# EAGLE schematic Sequencer-Memory-V1.0-3 (EAGLE 7.6.0)

## Sheet 1 of 4: Memory
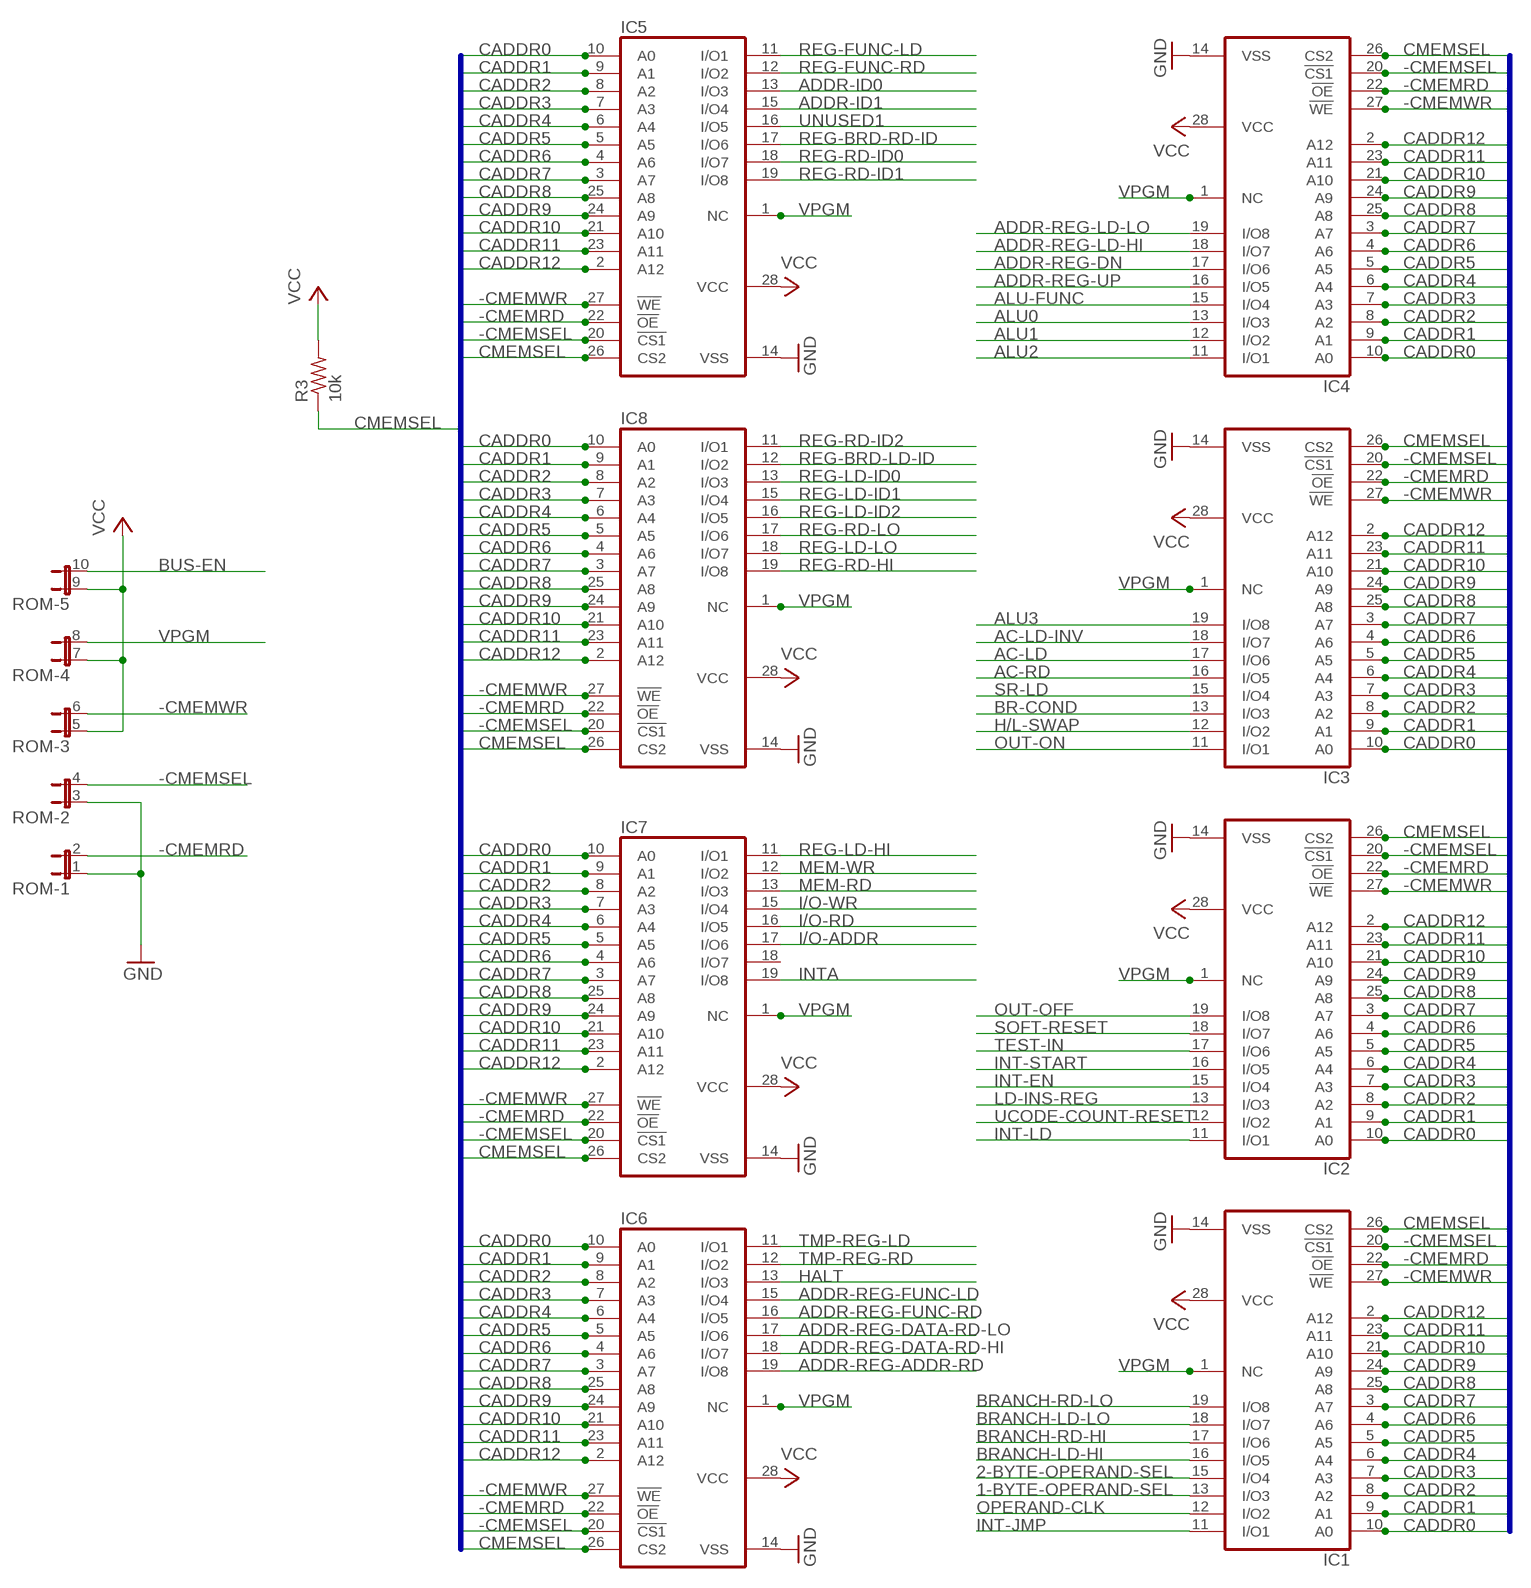
[diagram p0: schematic, sheet 1]

### Parts
IC1  6264A  [DIL28-6]
IC2  6264A  [DIL28-6]
IC3  6264A  [DIL28-6]
IC4  6264A  [DIL28-6]
IC5  6264A  [DIL28-6]
IC6  6264A  [DIL28-6]
IC7  6264A  [DIL28-6]
IC8  6264A  [DIL28-6]
R3  10k  R-US_0207/10  [0207/10]
ROM  JP5QE  [JP5Q]

### Nets
1-BYTE-OPERAND-SEL: IC1.13(I/O3) ; also sheet 2,4
2-BYTE-OPERAND-SEL: IC1.15(I/O4) ; also sheet 2,4
-CMEMRD: IC1.22(!OE) IC2.22(!OE) IC3.22(!OE) IC4.22(!OE) IC5.22(!OE) IC6.22(!OE) IC7.22(!OE) IC8.22(!OE) ROM.2 ; also sheet 3
-CMEMSEL: IC1.20(!CS1) IC2.20(!CS1) IC3.20(!CS1) IC4.20(!CS1) IC5.20(!CS1) IC6.20(!CS1) IC7.20(!CS1) IC8.20(!CS1) ROM.4 ; also sheet 3
-CMEMWR: IC1.27(!WE) IC2.27(!WE) IC3.27(!WE) IC4.27(!WE) IC5.27(!WE) IC6.27(!WE) IC7.27(!WE) IC8.27(!WE) ROM.6 ; also sheet 3
AC-LD: IC3.17(I/O6) ; also sheet 2,4
AC-LD-INV: IC3.18(I/O7) ; also sheet 2,4
AC-RD: IC3.16(I/O5) ; also sheet 2,4
ADDR-ID0: IC5.13(I/O3) ; also sheet 2,4
ADDR-ID1: IC5.15(I/O4) ; also sheet 2,4
ADDR-REG-ADDR-RD: IC6.19(I/O8) ; also sheet 2,4
ADDR-REG-DATA-RD-HI: IC6.18(I/O7) ; also sheet 2,4
ADDR-REG-DATA-RD-LO: IC6.17(I/O6) ; also sheet 2,4
ADDR-REG-DN: IC4.17(I/O6) ; also sheet 2,4
ADDR-REG-FUNC-LD: IC6.15(I/O4) ; also sheet 2,4
ADDR-REG-FUNC-RD: IC6.16(I/O5) ; also sheet 2,4
ADDR-REG-LD-HI: IC4.18(I/O7) ; also sheet 2,4
ADDR-REG-LD-LO: IC4.19(I/O8) ; also sheet 2,4
ADDR-REG-UP: IC4.16(I/O5) ; also sheet 2,4
ALU0: IC4.13(I/O3) ; also sheet 2,4
ALU1: IC4.12(I/O2) ; also sheet 2,4
ALU2: IC4.11(I/O1) ; also sheet 2,4
ALU3: IC3.19(I/O8) ; also sheet 2,4
ALU-FUNC: IC4.15(I/O4) ; also sheet 2,4
BR-COND: IC3.13(I/O3) ; also sheet 4
BRANCH-LD-HI: IC1.16(I/O5) ; also sheet 2,4
BRANCH-LD-LO: IC1.18(I/O7) ; also sheet 2,4
BRANCH-RD-HI: IC1.17(I/O6) ; also sheet 2,4
BRANCH-RD-LO: IC1.19(I/O8) ; also sheet 2,4
BUS-EN: ROM.10 ; also sheet 2,3
CADDR0: IC1.10(A0) IC2.10(A0) IC3.10(A0) IC4.10(A0) IC5.10(A0) IC6.10(A0) IC7.10(A0) IC8.10(A0) ; also sheet 2,4
CADDR1: IC1.9(A1) IC2.9(A1) IC3.9(A1) IC4.9(A1) IC5.9(A1) IC6.9(A1) IC7.9(A1) IC8.9(A1) ; also sheet 2,4
CADDR2: IC1.8(A2) IC2.8(A2) IC3.8(A2) IC4.8(A2) IC5.8(A2) IC6.8(A2) IC7.8(A2) IC8.8(A2) ; also sheet 2,4
CADDR3: IC1.7(A3) IC2.7(A3) IC3.7(A3) IC4.7(A3) IC5.7(A3) IC6.7(A3) IC7.7(A3) IC8.7(A3) ; also sheet 2,4
CADDR4: IC1.6(A4) IC2.6(A4) IC3.6(A4) IC4.6(A4) IC5.6(A4) IC6.6(A4) IC7.6(A4) IC8.6(A4) ; also sheet 2,4
CADDR5: IC1.5(A5) IC2.5(A5) IC3.5(A5) IC4.5(A5) IC5.5(A5) IC6.5(A5) IC7.5(A5) IC8.5(A5) ; also sheet 2,4
CADDR6: IC1.4(A6) IC2.4(A6) IC3.4(A6) IC4.4(A6) IC5.4(A6) IC6.4(A6) IC7.4(A6) IC8.4(A6) ; also sheet 2,4
CADDR7: IC1.3(A7) IC2.3(A7) IC3.3(A7) IC4.3(A7) IC5.3(A7) IC6.3(A7) IC7.3(A7) IC8.3(A7) ; also sheet 2,4
CADDR8: IC1.25(A8) IC2.25(A8) IC3.25(A8) IC4.25(A8) IC5.25(A8) IC6.25(A8) IC7.25(A8) IC8.25(A8) ; also sheet 2,4
CADDR9: IC1.24(A9) IC2.24(A9) IC3.24(A9) IC4.24(A9) IC5.24(A9) IC6.24(A9) IC7.24(A9) IC8.24(A9) ; also sheet 2,4
CADDR10: IC1.21(A10) IC2.21(A10) IC3.21(A10) IC4.21(A10) IC5.21(A10) IC6.21(A10) IC7.21(A10) IC8.21(A10) ; also sheet 2,4
CADDR11: IC1.23(A11) IC2.23(A11) IC3.23(A11) IC4.23(A11) IC5.23(A11) IC6.23(A11) IC7.23(A11) IC8.23(A11) ; also sheet 2,4
CADDR12: IC1.2(A12) IC2.2(A12) IC3.2(A12) IC4.2(A12) IC5.2(A12) IC6.2(A12) IC7.2(A12) IC8.2(A12) ; also sheet 2,4
CMEMSEL: IC1.26(CS2) IC2.26(CS2) IC3.26(CS2) IC4.26(CS2) IC5.26(CS2) IC6.26(CS2) IC7.26(CS2) IC8.26(CS2) R3.1
GND: IC1.14(VSS) IC2.14(VSS) IC3.14(VSS) IC4.14(VSS) IC5.14(VSS) IC6.14(VSS) IC7.14(VSS) IC8.14(VSS) ROM.1 ROM.3 ; also sheet 2,3,4
H/L-SWAP: IC3.12(I/O2) ; also sheet 2,4
HALT: IC6.13(I/O3) ; also sheet 2,4
I/O-ADDR: IC7.17(I/O6) ; also sheet 2,4
I/O-RD: IC7.16(I/O5) ; also sheet 2,4
I/O-WR: IC7.15(I/O4) ; also sheet 2,4
INT-EN: IC2.15(I/O4) ; also sheet 2,4
INT-JMP: IC1.11(I/O1) ; also sheet 2,4
INT-LD: IC2.11(I/O1) ; also sheet 2,4
INT-START: IC2.16(I/O5) ; also sheet 2,4
INTA: IC7.19(I/O8) ; also sheet 2,4
LD-INS-REG: IC2.13(I/O3) ; also sheet 2,4
MEM-RD: IC7.13(I/O3) ; also sheet 2,4
MEM-WR: IC7.12(I/O2) ; also sheet 2,4
OPERAND-CLK: IC1.12(I/O2) ; also sheet 2,4
OUT-OFF: IC2.19(I/O8) ; also sheet 2,4
OUT-ON: IC3.11(I/O1) ; also sheet 2,4
REG-BRD-LD-ID: IC8.12(I/O2) ; also sheet 2,4
REG-BRD-RD-ID: IC5.17(I/O6) ; also sheet 2,4
REG-FUNC-LD: IC5.11(I/O1) ; also sheet 2,4
REG-FUNC-RD: IC5.12(I/O2) ; also sheet 2,4
REG-LD-HI: IC7.11(I/O1) ; also sheet 2,4
REG-LD-ID0: IC8.13(I/O3) ; also sheet 2,4
REG-LD-ID1: IC8.15(I/O4) ; also sheet 2,4
REG-LD-ID2: IC8.16(I/O5) ; also sheet 2,4
REG-LD-LO: IC8.18(I/O7) ; also sheet 2,4
REG-RD-HI: IC8.19(I/O8) ; also sheet 2,4
REG-RD-ID0: IC5.18(I/O7) ; also sheet 2,4
REG-RD-ID1: IC5.19(I/O8) ; also sheet 2,4
REG-RD-ID2: IC8.11(I/O1) ; also sheet 2,4
REG-RD-LO: IC8.17(I/O6) ; also sheet 2,4
SOFT-RESET: IC2.18(I/O7) ; also sheet 2,4
SR-LD: IC3.15(I/O4) ; also sheet 2,4
TEST-IN: IC2.17(I/O6) ; also sheet 2
TMP-REG-LD: IC6.11(I/O1) ; also sheet 2,4
TMP-REG-RD: IC6.12(I/O2) ; also sheet 2,4
UCODE-COUNT-RESET: IC2.12(I/O2) ; also sheet 2,4
UNUSED1: IC5.16(I/O5) ; also sheet 2,4
VCC: IC1.28(VCC) IC2.28(VCC) IC3.28(VCC) IC4.28(VCC) IC5.28(VCC) IC6.28(VCC) IC7.28(VCC) IC8.28(VCC) R3.2 ROM.5 ROM.7 ROM.9 ; also sheet 2,3,4
VPGM: IC1.1(NC) IC2.1(NC) IC3.1(NC) IC4.1(NC) IC5.1(NC) IC6.1(NC) IC7.1(NC) IC8.1(NC) ROM.8
Unconnected: IC7.18(I/O7)

### Buses
CADDR[0..12],-CMEMWR,-CMEMRD,CMEMSEL,-CMEMSEL

## Sheet 2 of 4: Connector
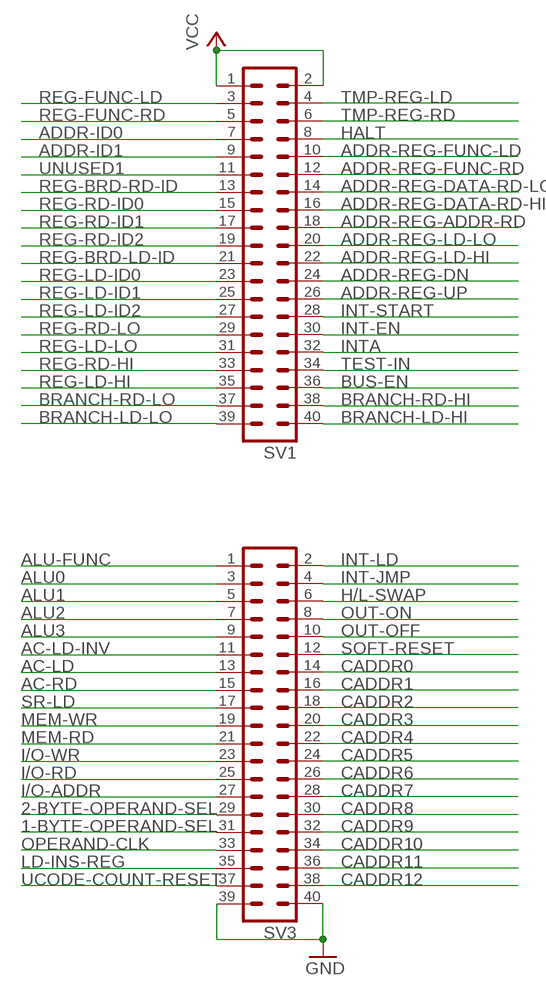
[diagram p1: schematic, sheet 2]

### Parts
SV1  MA20-2  [MA20-2]
SV3  MA20-2  [MA20-2]

### Nets
1-BYTE-OPERAND-SEL: SV3.31 ; also sheet 1,4
2-BYTE-OPERAND-SEL: SV3.29 ; also sheet 1,4
AC-LD: SV3.13 ; also sheet 1,4
AC-LD-INV: SV3.11 ; also sheet 1,4
AC-RD: SV3.15 ; also sheet 1,4
ADDR-ID0: SV1.7 ; also sheet 1,4
ADDR-ID1: SV1.9 ; also sheet 1,4
ADDR-REG-ADDR-RD: SV1.18 ; also sheet 1,4
ADDR-REG-DATA-RD-HI: SV1.16 ; also sheet 1,4
ADDR-REG-DATA-RD-LO: SV1.14 ; also sheet 1,4
ADDR-REG-DN: SV1.24 ; also sheet 1,4
ADDR-REG-FUNC-LD: SV1.10 ; also sheet 1,4
ADDR-REG-FUNC-RD: SV1.12 ; also sheet 1,4
ADDR-REG-LD-HI: SV1.22 ; also sheet 1,4
ADDR-REG-LD-LO: SV1.20 ; also sheet 1,4
ADDR-REG-UP: SV1.26 ; also sheet 1,4
ALU0: SV3.3 ; also sheet 1,4
ALU1: SV3.5 ; also sheet 1,4
ALU2: SV3.7 ; also sheet 1,4
ALU3: SV3.9 ; also sheet 1,4
ALU-FUNC: SV3.1 ; also sheet 1,4
BRANCH-LD-HI: SV1.40 ; also sheet 1,4
BRANCH-LD-LO: SV1.39 ; also sheet 1,4
BRANCH-RD-HI: SV1.38 ; also sheet 1,4
BRANCH-RD-LO: SV1.37 ; also sheet 1,4
BUS-EN: SV1.36 ; also sheet 1,3
CADDR0: SV3.14 ; also sheet 1,4
CADDR1: SV3.16 ; also sheet 1,4
CADDR2: SV3.18 ; also sheet 1,4
CADDR3: SV3.20 ; also sheet 1,4
CADDR4: SV3.22 ; also sheet 1,4
CADDR5: SV3.24 ; also sheet 1,4
CADDR6: SV3.26 ; also sheet 1,4
CADDR7: SV3.28 ; also sheet 1,4
CADDR8: SV3.30 ; also sheet 1,4
CADDR9: SV3.32 ; also sheet 1,4
CADDR10: SV3.34 ; also sheet 1,4
CADDR11: SV3.36 ; also sheet 1,4
CADDR12: SV3.38 ; also sheet 1,4
GND: SV3.39 SV3.40 ; also sheet 1,3,4
H/L-SWAP: SV3.6 ; also sheet 1,4
HALT: SV1.8 ; also sheet 1,4
I/O-ADDR: SV3.27 ; also sheet 1,4
I/O-RD: SV3.25 ; also sheet 1,4
I/O-WR: SV3.23 ; also sheet 1,4
INT-EN: SV1.30 ; also sheet 1,4
INT-JMP: SV3.4 ; also sheet 1,4
INT-LD: SV3.2 ; also sheet 1,4
INT-START: SV1.28 ; also sheet 1,4
INTA: SV1.32 ; also sheet 1,4
LD-INS-REG: SV3.35 ; also sheet 1,4
MEM-RD: SV3.21 ; also sheet 1,4
MEM-WR: SV3.19 ; also sheet 1,4
OPERAND-CLK: SV3.33 ; also sheet 1,4
OUT-OFF: SV3.10 ; also sheet 1,4
OUT-ON: SV3.8 ; also sheet 1,4
REG-BRD-LD-ID: SV1.21 ; also sheet 1,4
REG-BRD-RD-ID: SV1.13 ; also sheet 1,4
REG-FUNC-LD: SV1.3 ; also sheet 1,4
REG-FUNC-RD: SV1.5 ; also sheet 1,4
REG-LD-HI: SV1.35 ; also sheet 1,4
REG-LD-ID0: SV1.23 ; also sheet 1,4
REG-LD-ID1: SV1.25 ; also sheet 1,4
REG-LD-ID2: SV1.27 ; also sheet 1,4
REG-LD-LO: SV1.31 ; also sheet 1,4
REG-RD-HI: SV1.33 ; also sheet 1,4
REG-RD-ID0: SV1.15 ; also sheet 1,4
REG-RD-ID1: SV1.17 ; also sheet 1,4
REG-RD-ID2: SV1.19 ; also sheet 1,4
REG-RD-LO: SV1.29 ; also sheet 1,4
SOFT-RESET: SV3.12 ; also sheet 1,4
SR-LD: SV3.17 ; also sheet 1,4
TEST-IN: SV1.34 ; also sheet 1
TMP-REG-LD: SV1.4 ; also sheet 1,4
TMP-REG-RD: SV1.6 ; also sheet 1,4
UCODE-COUNT-RESET: SV3.37 ; also sheet 1,4
UNUSED1: SV1.11 ; also sheet 1,4
VCC: SV1.1 SV1.2 ; also sheet 1,3,4

## Sheet 3 of 4: CPU
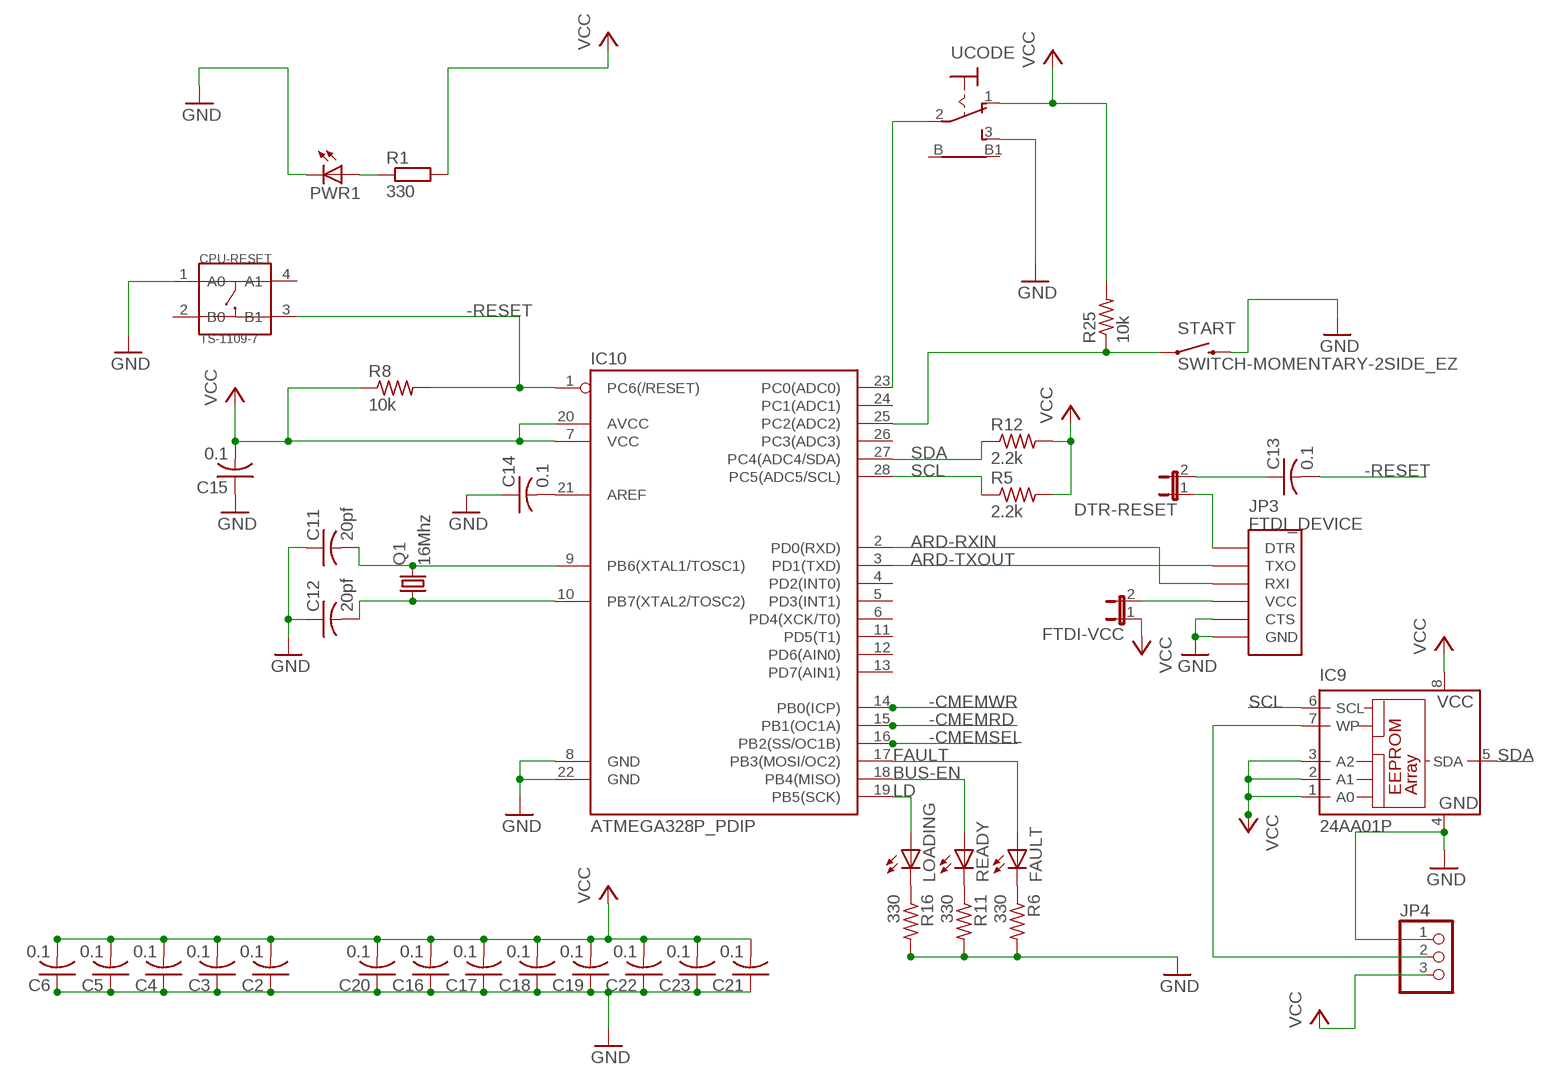
[diagram p2: schematic, sheet 3]

### Parts
C2  0.1  C-US025-024X044  [C025-024X044]
C3  0.1  C-US025-024X044  [C025-024X044]
C4  0.1  C-US025-024X044  [C025-024X044]
C5  0.1  C-US025-024X044  [C025-024X044]
C6  0.1  C-US025-024X044  [C025-024X044]
C11  20pf  C-US025-024X044  [C025-024X044]
C12  20pf  C-US025-024X044  [C025-024X044]
C13  0.1  C-US025-024X044  [C025-024X044]
C14  0.1  C-US025-024X044  [C025-024X044]
C15  0.1  C-US025-024X044  [C025-024X044]
C16  0.1  C-US025-024X044  [C025-024X044]
C17  0.1  C-US025-024X044  [C025-024X044]
C18  0.1  C-US025-024X044  [C025-024X044]
C19  0.1  C-US025-024X044  [C025-024X044]
C20  0.1  C-US025-024X044  [C025-024X044]
C21  0.1  C-US025-024X044  [C025-024X044]
C22  0.1  C-US025-024X044  [C025-024X044]
C23  0.1  C-US025-024X044  [C025-024X044]
CPU-RESET  TS-1109-7  DIP-BUTTON-TOP-BLACK(4P-D6.2MM)  [SW4-6.2X6.2X5.0MM]
DTR-RESET  JP1E  [JP1]
FAULT  LED5MM  [LED5MM]
FTDI-VCC  JP1E  [JP1]
IC9  24AA01P  [DIL8]
IC10  ATMEGA328P_PDIP  [DIL28-3]
JP3  FTDI_DEVICE  [FTDI_DEVICE_SIDE]
JP4  PINHD-1X3  [1X03]
LOADING  LED5MM  [LED5MM]
PWR1  LED5MM  [LED5MM]
Q1  16Mhz  CRYSTALHC49S  [HC49/S]
R1  330  R0207/10  [0207/10]
R5  2.2k  R-US_0207/10  [0207/10]
R6  330  R-US_0207/10  [0207/10]
R8  10k  R-US_0207/10  [0207/10]
R11  330  R-US_0207/10  [0207/10]
R12  2.2k  R-US_0207/10  [0207/10]
R16  330  R-US_0207/10  [0207/10]
R25  10k  R-US_0207/10  [0207/10]
READY  LED5MM  [LED5MM]
START  SWITCH-MOMENTARY-2SIDE_EZ  [TACTILE-PTH-SIDEEZ]
UCODE  9070-1W  [9070-1W]

### Nets
-CMEMRD: IC10.15(PB1(OC1A)) ; also sheet 1
-CMEMSEL: IC10.16(PB2(SS/OC1B)) ; also sheet 1
-CMEMWR: IC10.14(PB0(ICP)) ; also sheet 1
-RESET: C13.2 CPU-RESET.3(B1) IC10.1(PC6(/RESET)) R8.2 ; also sheet 4
ARD-RXIN: IC10.2(PD0(RXD)) JP3.P$3(RXI)
ARD-TXOUT: IC10.3(PD1(TXD)) JP3.P$2(TXO)
BUS-EN: IC10.18(PB4(MISO)) READY.A ; also sheet 1,2
FAULT: FAULT.A IC10.17(PB3(MOSI/OC2))
GND: C2.1 C3.1 C4.1 C5.1 C6.1 C11.1 C12.1 C14.1 C15.1 C16.1 C17.1 C18.1 C19.1 C20.1 C21.1 C22.1 C23.1 CPU-RESET.1(A0) IC9.4(GND) IC10.8(GND) IC10.22(GND) JP3.P$5(CTS) JP3.P$6(GND) JP4.1 PWR1.K(C) R6.2 R11.2 R16.2 START.2 UCODE.3(S) ; also sheet 1,2,4
LD: IC10.19(PB5(SCK)) LOADING.A
N$1: PWR1.A R1.1
N$6: C11.2 IC10.9(PB6(XTAL1/TOSC1)) Q1.2
N$7: C12.2 IC10.10(PB7(XTAL2/TOSC2)) Q1.1
N$8: C13.1 DTR-RESET.2
N$17: C14.2 IC10.21(AREF)
N$25: R11.1 READY.K(C)
N$26: LOADING.K(C) R16.1
N$27: FAULT.K(C) R6.1
N$30: IC10.23(PC0(ADC0)) UCODE.2(P)
N$32: IC9.7(WP) JP4.2
N$33: DTR-RESET.1 JP3.P$1(DTR)
N$34: FTDI-VCC.2 JP3.P$4(VCC)
N$39: IC10.25(PC2(ADC2)) R25.1 START.1
SCL: IC9.6(SCL) IC10.28(PC5(ADC5/SCL)) R5.1 ; also sheet 4
SDA: IC9.5(SDA) IC10.27(PC4(ADC4/SDA)) R12.1 ; also sheet 4
VCC: C2.2 C3.2 C4.2 C5.2 C6.2 C15.2 C16.2 C17.2 C18.2 C19.2 C20.2 C21.2 C22.2 C23.2 FTDI-VCC.1 IC9.1(A0) IC9.2(A1) IC9.3(A2) IC9.8(VCC) IC10.7(VCC) IC10.20(AVCC) JP4.3 R1.2 R5.2 R8.1 R12.2 R25.2 UCODE.1(O) ; also sheet 1,2,4
Unconnected: CPU-RESET.2(B0) CPU-RESET.4(A1) IC10.4(PD2(INT0)) IC10.5(PD3(INT1)) IC10.6(PD4(XCK/T0)) IC10.11(PD5(T1)) IC10.12(PD6(AIN0)) IC10.13(PD7(AIN1)) IC10.24(PC1(ADC1)) IC10.26(PC3(ADC3)) UCODE.B UCODE.B1

## Sheet 4 of 4: IO
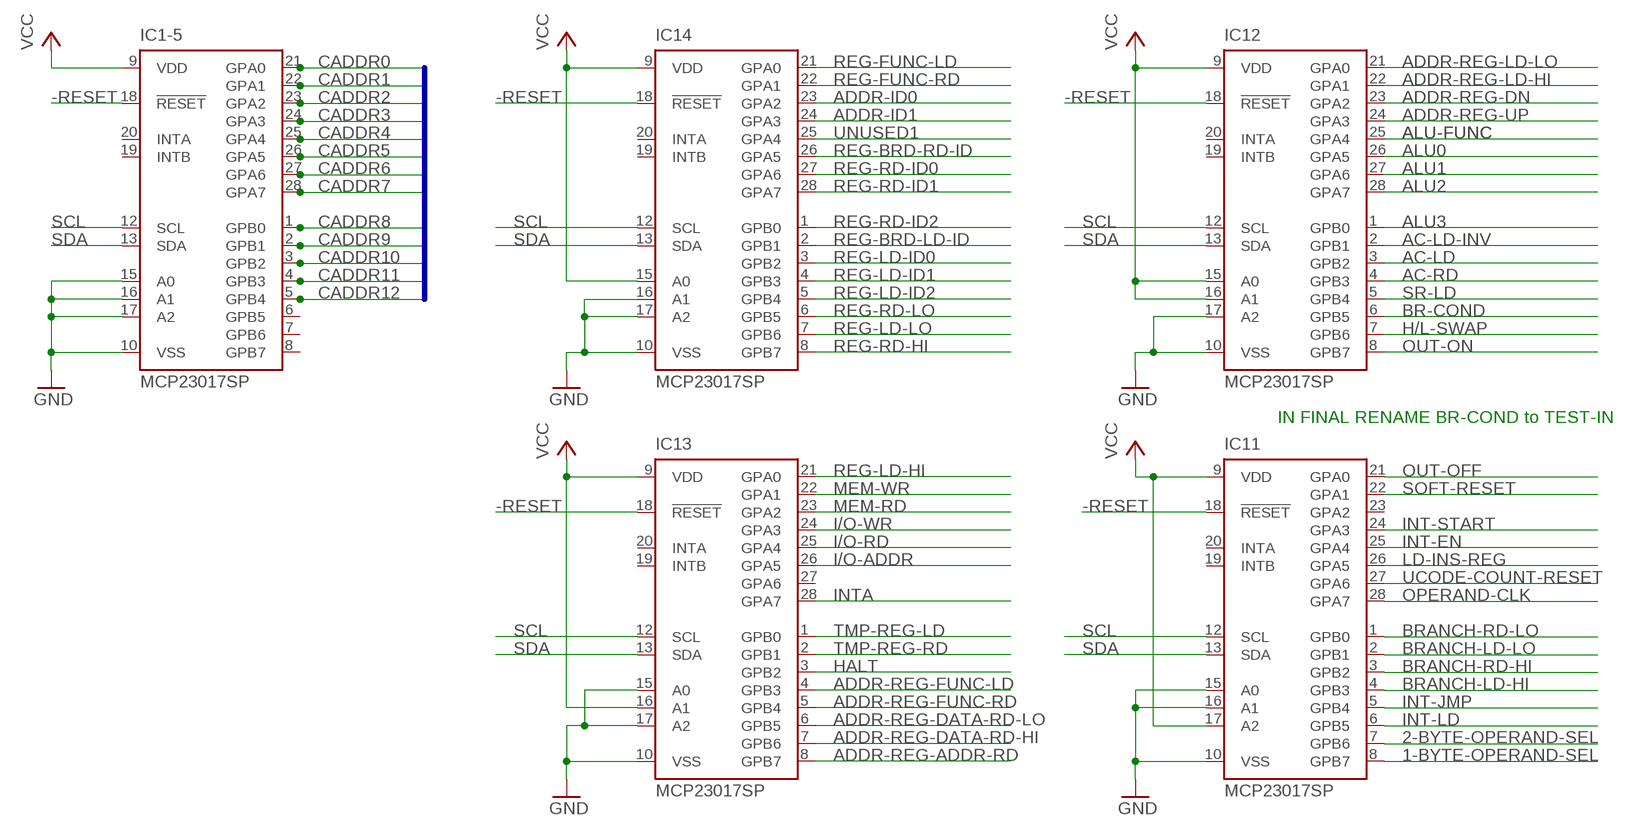
[diagram p3: schematic, sheet 4]

### Parts
IC1-5  MCP23017SP  [DIL28-3]
IC11  MCP23017SP  [DIL28-3]
IC12  MCP23017SP  [DIL28-3]
IC13  MCP23017SP  [DIL28-3]
IC14  MCP23017SP  [DIL28-3]

### Nets
1-BYTE-OPERAND-SEL: IC11.8(GPB7) ; also sheet 1,2
2-BYTE-OPERAND-SEL: IC11.7(GPB6) ; also sheet 1,2
-RESET: IC1-5.18(!RESET) IC11.18(!RESET) IC12.18(!RESET) IC13.18(!RESET) IC14.18(!RESET) ; also sheet 3
AC-LD: IC12.3(GPB2) ; also sheet 1,2
AC-LD-INV: IC12.2(GPB1) ; also sheet 1,2
AC-RD: IC12.4(GPB3) ; also sheet 1,2
ADDR-ID0: IC14.23(GPA2) ; also sheet 1,2
ADDR-ID1: IC14.24(GPA3) ; also sheet 1,2
ADDR-REG-ADDR-RD: IC13.8(GPB7) ; also sheet 1,2
ADDR-REG-DATA-RD-HI: IC13.7(GPB6) ; also sheet 1,2
ADDR-REG-DATA-RD-LO: IC13.6(GPB5) ; also sheet 1,2
ADDR-REG-DN: IC12.23(GPA2) ; also sheet 1,2
ADDR-REG-FUNC-LD: IC13.4(GPB3) ; also sheet 1,2
ADDR-REG-FUNC-RD: IC13.5(GPB4) ; also sheet 1,2
ADDR-REG-LD-HI: IC12.22(GPA1) ; also sheet 1,2
ADDR-REG-LD-LO: IC12.21(GPA0) ; also sheet 1,2
ADDR-REG-UP: IC12.24(GPA3) ; also sheet 1,2
ALU0: IC12.26(GPA5) ; also sheet 1,2
ALU1: IC12.27(GPA6) ; also sheet 1,2
ALU2: IC12.28(GPA7) ; also sheet 1,2
ALU3: IC12.1(GPB0) ; also sheet 1,2
ALU-FUNC: IC12.25(GPA4) ; also sheet 1,2
BR-COND: IC12.6(GPB5) ; also sheet 1
BRANCH-LD-HI: IC11.4(GPB3) ; also sheet 1,2
BRANCH-LD-LO: IC11.2(GPB1) ; also sheet 1,2
BRANCH-RD-HI: IC11.3(GPB2) ; also sheet 1,2
BRANCH-RD-LO: IC11.1(GPB0) ; also sheet 1,2
CADDR0: IC1-5.21(GPA0) ; also sheet 1,2
CADDR1: IC1-5.22(GPA1) ; also sheet 1,2
CADDR2: IC1-5.23(GPA2) ; also sheet 1,2
CADDR3: IC1-5.24(GPA3) ; also sheet 1,2
CADDR4: IC1-5.25(GPA4) ; also sheet 1,2
CADDR5: IC1-5.26(GPA5) ; also sheet 1,2
CADDR6: IC1-5.27(GPA6) ; also sheet 1,2
CADDR7: IC1-5.28(GPA7) ; also sheet 1,2
CADDR8: IC1-5.1(GPB0) ; also sheet 1,2
CADDR9: IC1-5.2(GPB1) ; also sheet 1,2
CADDR10: IC1-5.3(GPB2) ; also sheet 1,2
CADDR11: IC1-5.4(GPB3) ; also sheet 1,2
CADDR12: IC1-5.5(GPB4) ; also sheet 1,2
GND: IC1-5.10(VSS) IC1-5.15(A0) IC1-5.16(A1) IC1-5.17(A2) IC11.10(VSS) IC11.15(A0) IC11.16(A1) IC12.10(VSS) IC12.17(A2) IC13.10(VSS) IC13.15(A0) IC13.17(A2) IC14.10(VSS) IC14.16(A1) IC14.17(A2) ; also sheet 1,2,3
H/L-SWAP: IC12.7(GPB6) ; also sheet 1,2
HALT: IC13.3(GPB2) ; also sheet 1,2
I/O-ADDR: IC13.26(GPA5) ; also sheet 1,2
I/O-RD: IC13.25(GPA4) ; also sheet 1,2
I/O-WR: IC13.24(GPA3) ; also sheet 1,2
INT-EN: IC11.25(GPA4) ; also sheet 1,2
INT-JMP: IC11.5(GPB4) ; also sheet 1,2
INT-LD: IC11.6(GPB5) ; also sheet 1,2
INT-START: IC11.24(GPA3) ; also sheet 1,2
INTA: IC13.28(GPA7) ; also sheet 1,2
LD-INS-REG: IC11.26(GPA5) ; also sheet 1,2
MEM-RD: IC13.23(GPA2) ; also sheet 1,2
MEM-WR: IC13.22(GPA1) ; also sheet 1,2
OPERAND-CLK: IC11.28(GPA7) ; also sheet 1,2
OUT-OFF: IC11.21(GPA0) ; also sheet 1,2
OUT-ON: IC12.8(GPB7) ; also sheet 1,2
REG-BRD-LD-ID: IC14.2(GPB1) ; also sheet 1,2
REG-BRD-RD-ID: IC14.26(GPA5) ; also sheet 1,2
REG-FUNC-LD: IC14.21(GPA0) ; also sheet 1,2
REG-FUNC-RD: IC14.22(GPA1) ; also sheet 1,2
REG-LD-HI: IC13.21(GPA0) ; also sheet 1,2
REG-LD-ID0: IC14.3(GPB2) ; also sheet 1,2
REG-LD-ID1: IC14.4(GPB3) ; also sheet 1,2
REG-LD-ID2: IC14.5(GPB4) ; also sheet 1,2
REG-LD-LO: IC14.7(GPB6) ; also sheet 1,2
REG-RD-HI: IC14.8(GPB7) ; also sheet 1,2
REG-RD-ID0: IC14.27(GPA6) ; also sheet 1,2
REG-RD-ID1: IC14.28(GPA7) ; also sheet 1,2
REG-RD-ID2: IC14.1(GPB0) ; also sheet 1,2
REG-RD-LO: IC14.6(GPB5) ; also sheet 1,2
SCL: IC1-5.12(SCL) IC11.12(SCL) IC12.12(SCL) IC13.12(SCL) IC14.12(SCL) ; also sheet 3
SDA: IC1-5.13(SDA) IC11.13(SDA) IC12.13(SDA) IC13.13(SDA) IC14.13(SDA) ; also sheet 3
SOFT-RESET: IC11.22(GPA1) ; also sheet 1,2
SR-LD: IC12.5(GPB4) ; also sheet 1,2
TMP-REG-LD: IC13.1(GPB0) ; also sheet 1,2
TMP-REG-RD: IC13.2(GPB1) ; also sheet 1,2
UCODE-COUNT-RESET: IC11.27(GPA6) ; also sheet 1,2
UNUSED1: IC14.25(GPA4) ; also sheet 1,2
VCC: IC1-5.9(VDD) IC11.9(VDD) IC11.17(A2) IC12.9(VDD) IC12.15(A0) IC12.16(A1) IC13.9(VDD) IC13.16(A1) IC14.9(VDD) IC14.15(A0) ; also sheet 1,2,3
Unconnected: IC1-5.6(GPB5) IC1-5.7(GPB6) IC1-5.8(GPB7) IC1-5.19(INTB) IC1-5.20(INTA) IC11.19(INTB) IC11.20(INTA) IC11.23(GPA2) IC12.19(INTB) IC12.20(INTA) IC13.19(INTB) IC13.20(INTA) IC13.27(GPA6) IC14.19(INTB) IC14.20(INTA)

### Buses
CADDR[0..12]

### Notes on the sheet
- IN FINAL RENAME BR-COND to TEST-IN

## Library data of the parts
C2-C6 C11-C23 = adafruit:C-US: CAPACITOR, American symbol
CPU-RESET = Seeed-OPL-Switch:DIP-BUTTON-TOP-BLACK(4P-D6.2MM): 311020032; MPN: TS-1109-7
DTR-RESET FTDI-VCC = jumper:JP1E: JUMPER
FAULT LOADING PWR1 READY = led:LED: LED OSRAM: - CHIPLED LG R971, LG N971, LY N971, LG Q971, LY Q971, LO R971, LY R971 LH N974, LH R974 LS Q976, LO Q976, LY Q976 LO Q996 - Hyper CHIPLED LW Q18S LB Q993, LB Q99A, LB R99A - SideLED LS A670, LO A670, LY A670, LG A670, LP A670 LB A673, LV A673, LT A673, LW A673 LH A674 LY A675 LS A676, LA A676, LO A676, LY A676, LW A676 LS A679, LY A679, LG A679 - Hyper Micro SIDELED® LS Y876, LA Y876, LO Y876, LY Y876 LT Y87S - SmartLED LW L88C, LW L88S LB L89C, LB L89S, LG L890 LS L89K, LO L89K, LY L89K LS L896, LA L896, LO L896, LY L896 - TOPLED LS T670, LO T670, LY T670, LG T670, LP T670 LSG T670, LSP T670, LSY T670, LOP T670, LYG T670 LG T671, LOG T671, LSG T671 LB T673, LV T673, LT T673, LW T673 LH T674 LS T676, LA T676, LO T676, LY T676, LB T676, LH T676, LSB T676, LW T676 LB T67C, LV T67C, LT T67C, LS T67K, LO T67K, LY T67K, LW E67C LS E67B, LA E67B, LO E67B, LY E67B, LB E67C, LV E67C, LT E67C LW T67C LS T679, LY T679, LG T679 LS T770, LO T770, LY T770, LG T770, LP T770 LB T773, LV T773, LT T773, LW T773 LH T774 LS E675, LA E675, LY E675, LS T675 LS T776, LA T776, LO T776, LY T776, LB T776 LHGB T686 LT T68C, LB T68C - Hyper Mini TOPLED® LB M676 - Mini TOPLED Santana® LG M470 LS M47K, LO M47K, LY M47K Source: http://www.osram.convergy.de LUXEON: - LUMILED® LXK2-PW12-R00, LXK2-PW12-S00, LXK2-PW14-U00, LXK2-PW14-V00 LXK2-PM12-R00, LXK2-PM12-S00, LXK2-PM14-U00 LXK2-PE12-Q00, LXK2-PE12-R00, LXK2-PE12-S00, LXK2-PE14-T00, LXK2-PE14-U00 LXK2-PB12-K00, LXK2-PB12-L00, LXK2-PB12-M00, LXK2-PB14-N00, LXK2-PB14-P00, LXK2-PB14-Q00 LXK2-PR12-L00, LXK2-PR12-M00, LXK2-PR14-Q00, LXK2-PR14-R00 LXK2-PD12-Q00, LXK2-PD12-R00, LXK2-PD12-S00 LXK2-PH12-R00, LXK2-PH12-S00 LXK2-PL12-P00, LXK2-PL12-Q00, LXK2-PL12-R00 Source: www.luxeon.com KINGBRIGHT: KA-3528ASYC Source: www.kingbright.com
IC1-IC8 = memory-hitachi:6264A: MEMORY; OC_FARNELL: 283605; OC_NEWARK: unknown
IC1-5 IC11-IC14 = microchip:MCP23017: http://ww1.microchip.com/downloads/en/DeviceDoc/21952a.pdf Source: http://ww1.microchip.com/downloads/en/DeviceDoc/21952a.pdf; MF: MICROCHIP; MPN: MCP23017-E/SP; OC_FARNELL: 1332088; OC_NEWARK: 31K2959
IC9 = microchip:24*: Serial EEPROM I2C; MPN: 24AA01-I/P; OC_FARNELL: 1331266; OC_NEWARK: 35M0692
IC10 = SparkFun-DigitalIC:ATMEGA328P_PDIP: uC used in the Arduino 32kb flash, 1k EEPROM, 2k SRAM This is the through-hole version of this chip.
JP3 = SparkFun-Connectors:FTDI_DEVICE: Connector which mates to FTDI basic or FTDI cable.
JP4 = pinhead:PINHD-1X3: PIN HEADER
Q1 = crystal:CRYSTAL: CRYSTAL; OC_FARNELL: 1667008; OC_NEWARK: unknown
R1 = eagle-ltspice:R: RESISTOR, European symbol; SPICEMODEL: NONE; SPICEPREFIX: R
R3 R5 R6 R8 R11 R12 R16 R25 = resistor:R-US_: RESISTOR, American symbol
ROM = jumper:JP5QE: JUMPER
START = SparkFun-Electromechanical:SWITCH-MOMENTARY-2: Various NO switches- pushbuttons, reed, etc
SV1 SV3 = con-lstb:MA20-2: PIN HEADER; OC_FARNELL: unknown; OC_NEWARK: unknown
UCODE = switch:9070-1W: TOGGLE SWITCH Marquardt